# EAGLE design lattice-isp (EAGLE 6.3)
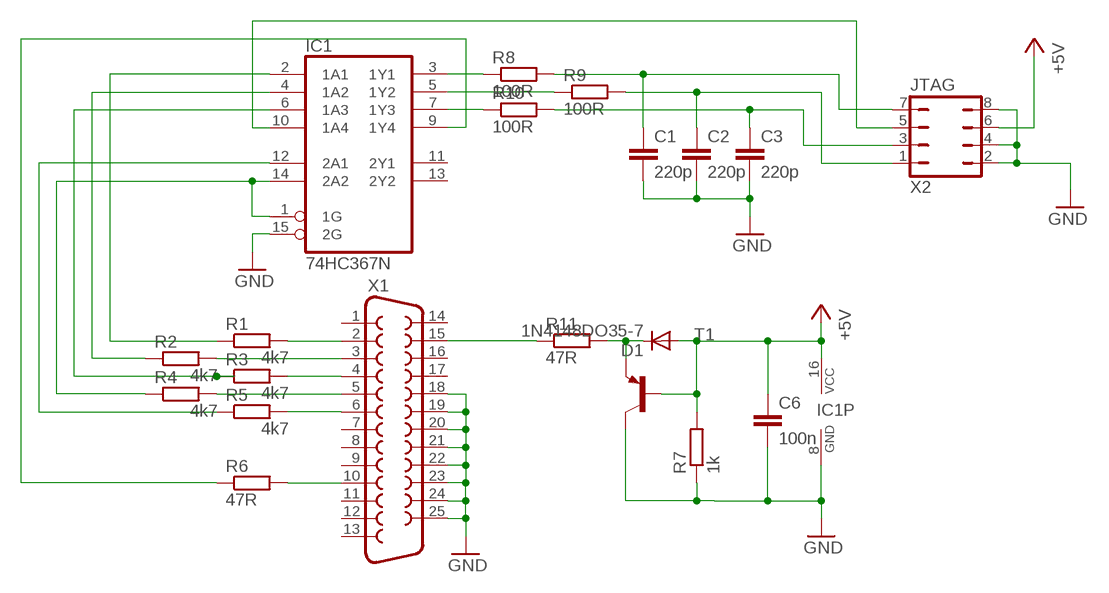
[diagram p0: schematic, sheet 1]

## Parts
C1  220p  C-EU025-024X044  [C025-024X044]
C2  220p  C-EU025-024X044  [C025-024X044]
C3  220p  C-EU025-024X044  [C025-024X044]
C6  100n  C-EU050-024X044  [C050-024X044]
D1  1N4148DO35-7  [DO35-7]
IC1  74HC367N  [DIL16]
R1  4k7  R-EU_0207/10  [0207/10]
R2  4k7  R-EU_0207/10  [0207/10]
R3  4k7  R-EU_0207/10  [0207/10]
R4  4k7  R-EU_0207/10  [0207/10]
R5  4k7  R-EU_0207/10  [0207/10]
R6  47R  R-EU_0207/10  [0207/10]
R7  1k  R-EU_0207/10  [0207/10]
R8  100R  R-EU_0207/10  [0207/10]
R9  100R  R-EU_0207/10  [0207/10]
R10  100R  R-EU_0207/10  [0207/10]
R11  47R  R-EU_0207/10  [0207/10]
T1  BC636-PNP-TO92-BCE  [TO92-BCE]
X1  F25HP  [F25HP]
X2  JTAG  JP4Q  [JP4Q]

## Nets
+5V: C6.1 D1.A IC1.16(VCC) R7.2 T1.B X2.6
GND: C1.2 C2.2 C3.2 C6.2 IC1.8(GND) IC1.15(2G) R7.1 T1.C X1.18 X1.19 X1.20 X1.21 X1.22 X1.23 X1.24 X1.25 X2.2 X2.4 X2.8
N$1: IC1.3(1Y1) R8.1
N$2: R1.2 X1.2
N$3: R2.2 X1.3
N$4: R3.2 X1.4
N$5: R4.2 X1.5
N$6: R5.2 X1.6
N$7: R6.2 X1.10
N$8: IC1.2(1A1) R1.1
N$9: IC1.4(1A2) R2.1
N$10: IC1.6(1A3) R3.1
N$11: IC1.1(1G) IC1.14(2A2) R4.1
N$13: IC1.12(2A1) R5.1
N$14: IC1.9(1Y4) R6.1
N$15: IC1.5(1Y2) R9.1
N$16: IC1.7(1Y3) R10.1
N$19: C3.1 R10.2 X2.3
N$21: D1.C R11.2 T1.E
N$22: R11.1 X1.15
TCK: C2.1 R9.2 X2.1
TDI: C1.1 R8.2 X2.7
TDO: IC1.10(1A4) X2.5
Unconnected: IC1.11(2Y1) IC1.13(2Y2) X1.1 X1.7 X1.8 X1.9 X1.11 X1.12 X1.13 X1.14 X1.16 X1.17

## Library data of the parts
C1-C3 C6 = rcl:C-EU: CAPACITOR, European symbol
D1 = diode:1N4148: DIODE high speed (Philips)
IC1 = 74xx-eu:74*367: Hex BUS DRIVER, 3-state
R1-R11 = rcl:R-EU_: RESISTOR, European symbol
T1 = transistor:*-PNP-: PNP Transistror
X1 = con-subd:F25: SUB-D; OC_FARNELL: unknown; OC_NEWARK: unknown
X2 = jumper:JP4Q: JUMPER

## Board
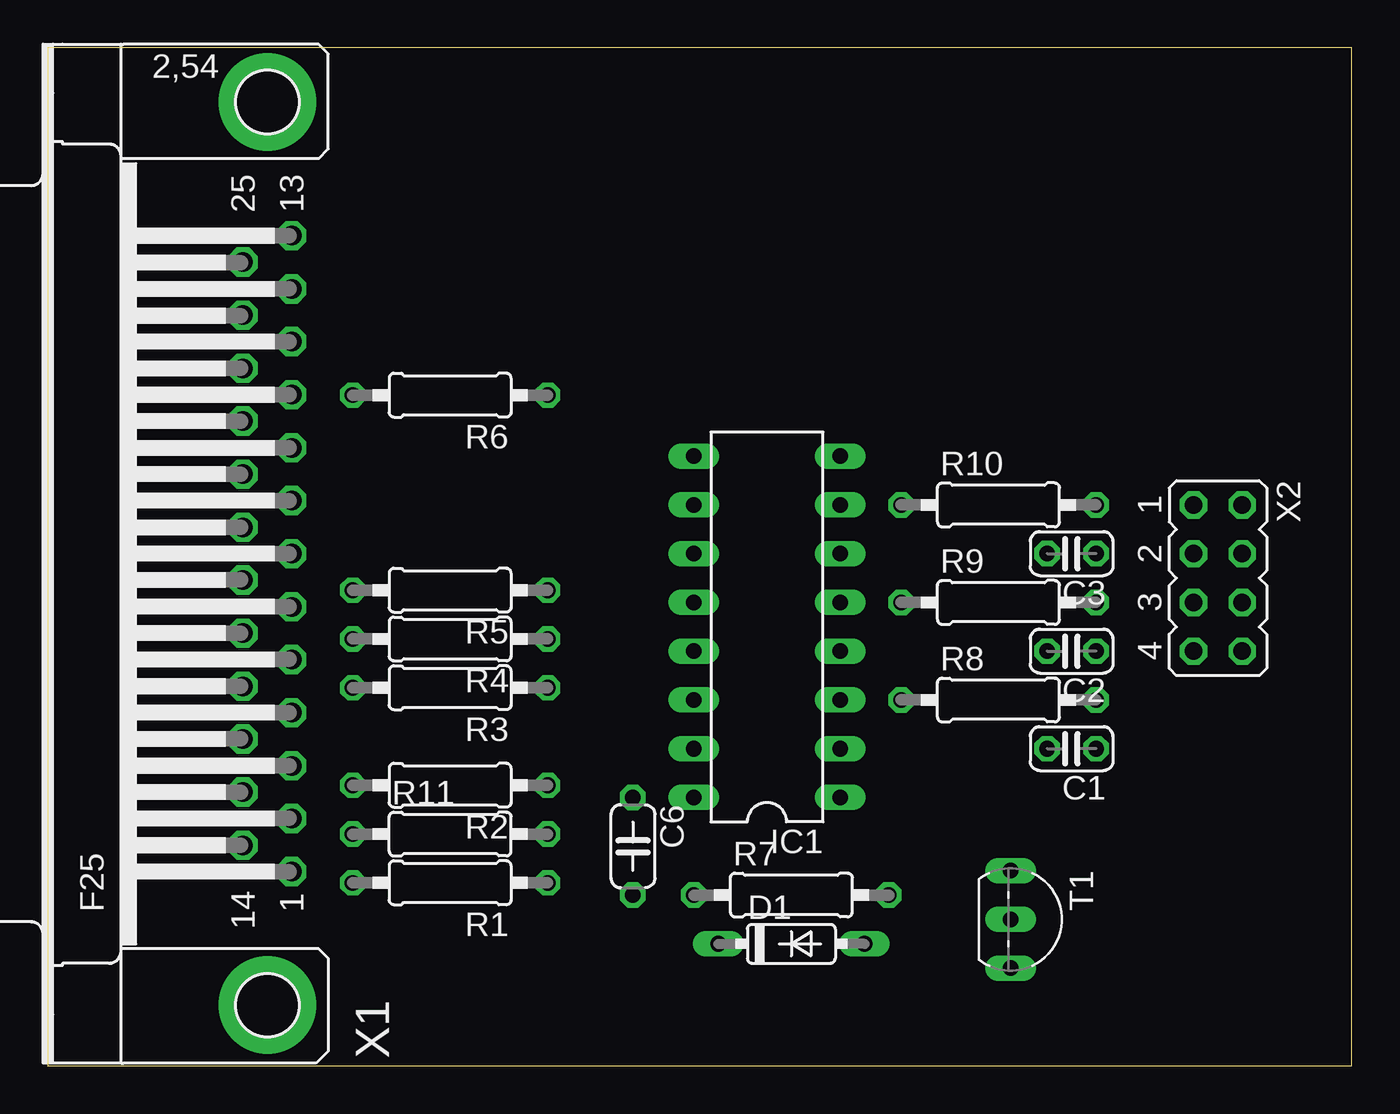
[diagram p1: board, top side]
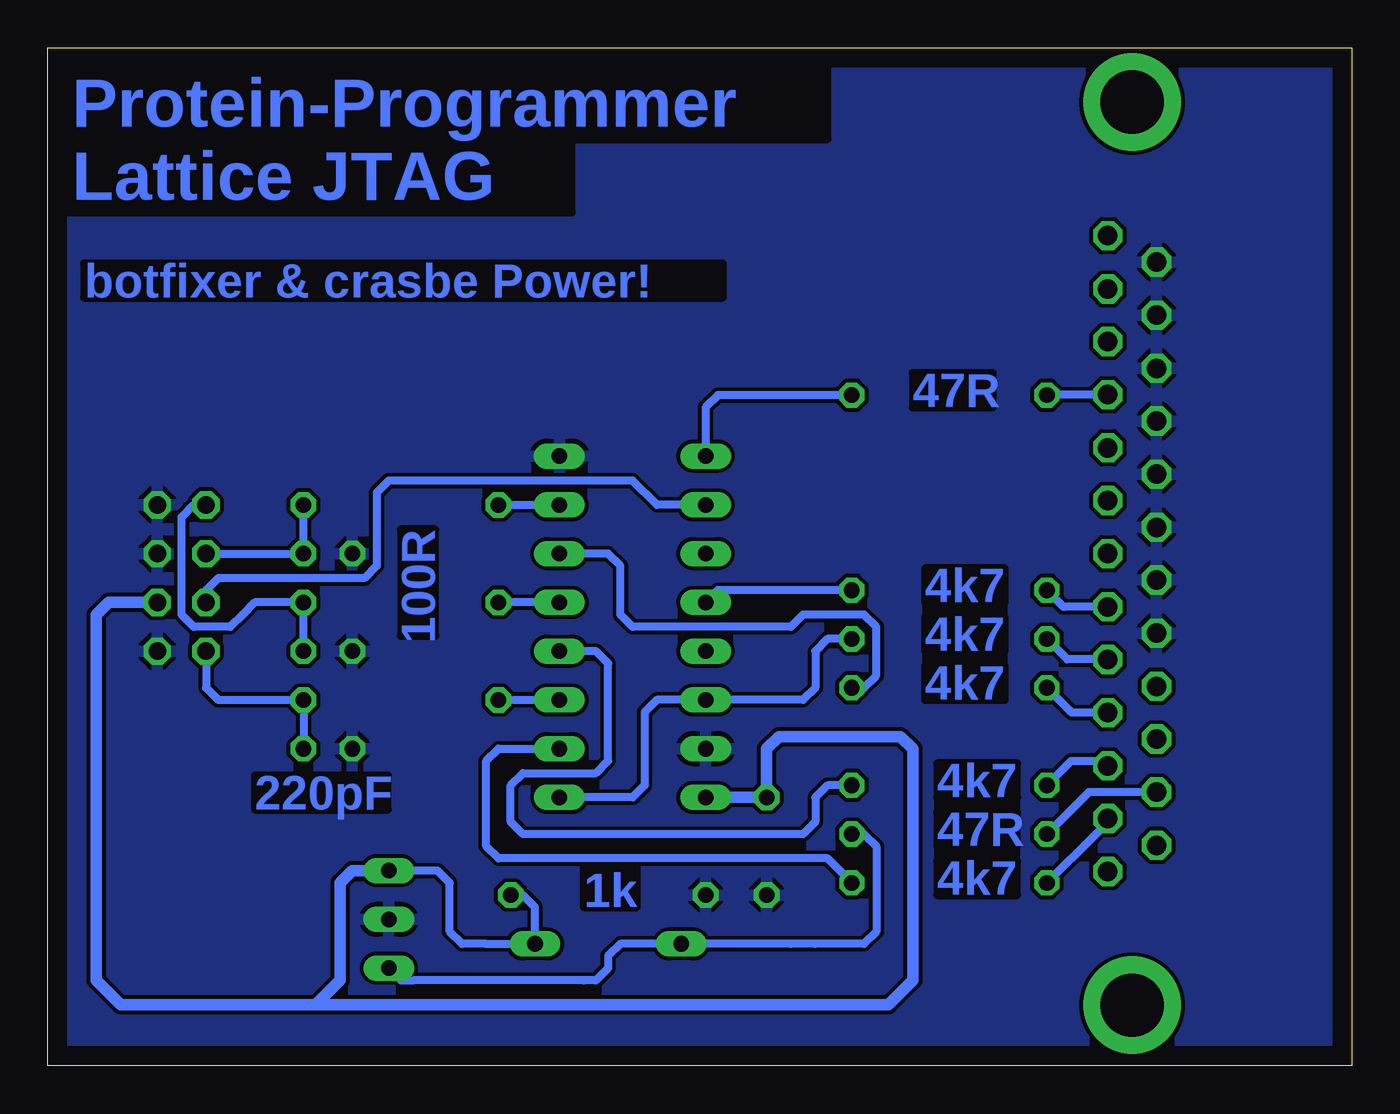
[diagram p2: board, bottom side, seen from below]

Size 67.92 x 53.01 mm. Coordinates in mm from the lower left corner, seen from the top.
Outline: 0,0 67.92,0 67.92,53.01 0,53.01 0,0
Copper layers (1*16): Top 0.035mm / dielectric 1.5mm / Bottom 0.035mm
Design rules "default": minimum track width 10mil, minimum drill 24mil, track to track 8mil, track to pad 8mil, pad to pad 8mil, via to via 8mil, smd to smd 8mil, copper to edge 40mil, drill to drill 8mil, minimum pad ring 10mil, minimum via ring 8mil, stop-mask expansion 4mil, vias tented up to drill 0mil, thermal gap 10mil

### Footprints (pad centres in the part's own frame; a part is rotated, then mirrored left to right if it is on the bottom)
C025-024X044 = drill 0.813 octagon: 1 -1.27,0; 2 1.27,0
C050-024X044 = drill 0.813 octagon: 1 -2.54,0; 2 2.54,0
DO35-7 = drill 0.813 long: A 3.81,0; C -3.81,0
DIL16 = drill 0.813 long: 1 -8.89,-3.81; 2 -6.35,-3.81; 3 -3.81,-3.81; 4 -1.27,-3.81; 5 1.27,-3.81; 6 3.81,-3.81; 7 6.35,-3.81; 8 8.89,-3.81; 9 8.89,3.81; 10 6.35,3.81; 11 3.81,3.81; 12 1.27,3.81; 13 -1.27,3.81; 14 -3.81,3.81; 15 -6.35,3.81; 16 -8.89,3.81
0207/10 = drill 0.813 octagon: 1 -5.08,0; 2 5.08,0
TO92-BCE = drill 0.813 long: B -2.54,0; C 0,0; E 2.54,0
F25HP = drill 1.016 octagon: 1 -16.561,-1.27; 2 -13.792,-1.27; 3 -11.049,-1.27; 4 -8.28,-1.27; 5 -5.512,-1.27; 6 -2.769,-1.27; 7 0,-1.27; 8 2.769,-1.27; 9 5.512,-1.27; 10 8.28,-1.27; 11 11.049,-1.27; 12 13.792,-1.27; 13 16.561,-1.27; 14 -15.189,1.27; 15 -12.421,1.27; 16 -9.652,1.27; 17 -6.909,1.27; 18 -4.14,1.27; 19 -1.372,1.27; 20 1.372,1.27; 21 4.14,1.27; 22 6.909,1.27; 23 9.652,1.27; 24 12.421,1.27; 25 15.189,1.27 | drill 3.302 pad 5.08: G1 -23.52,0; G2 23.52,0
JP4Q = drill 0.914 octagon: 1 -3.81,-1.27; 2 -3.81,1.27; 3 -1.27,-1.27; 4 -1.27,1.27; 5 1.27,-1.27; 6 1.27,1.27; 7 3.81,-1.27; 8 3.81,1.27

### Placement (x,y rotation side)
C1  53.34,16.51 180 top
C2  53.34,21.59 180 top
C3  53.34,26.67 180 top
C6  30.48,11.43 270 top
D1  38.73,6.35 0 top
IC1  37.47,22.86 90 top
R1  20.95,9.53 180 top
R2  20.95,14.61 180 top
R3  20.95,19.68 180 top
R4  20.95,22.23 180 top
R5  20.95,24.77 180 top
R6  20.95,34.92 180 top
R7  38.73,8.89 0 top
R8  49.53,19.05 0 top
R9  49.53,24.13 0 top
R10  49.53,29.21 0 top
R11  20.95,12.06 0 top
T1  50.16,7.62 270 top
X1  11.43,26.67 90 top
X2  60.96,25.4 270 top

### Tracks (layer width: path | path; a pad name or v marks a point on that pad's centre or on a via)
+5V
  Bottom 0.406: R7.2 43.18,8.89 42.55,8.26 D1.A 45.09,6.35 46.35,6.35 46.99,6.99 46.99,9.53 47.62,10.16 T1.B
  Bottom 0.61: IC1.16 C6.1 30.48,16.51 29.84,17.14 23.5,17.14 22.86,16.51 22.86,4.45 24.13,3.17 54.61,3.17 | 54.61,3.17 64.14,3.17 65.41,4.45 65.41,23.5 64.77,24.13 X2.6 | 54.61,3.17 53.98,3.17 52.7,4.45 52.7,9.53 52.07,10.16 T1.B
GND
  pour Bottom: 0,52.7 0,0 67.94,0 67.94,52.7
N$1
  Bottom 0.406: R8.1 IC1.3
N$2
  Bottom 0.406: R1.2 13.34,12.06 12.7,12.7 12.88,12.7 X1.2
N$3
  Bottom 0.406: R2.2 14.61,15.88 12.95,15.88 X1.3
N$4
  Bottom 0.406: X1.4 14.58,18.39 R3.2
N$5
  Bottom 0.406: X1.5 14.81,21.16 R4.2
N$6
  Bottom 0.406: X1.6 15.01,23.9 R5.2
N$7
  Bottom 0.406: X1.10 15.85,34.95 R6.2
N$8
  Bottom 0.406: R1.1 27.3,10.79 44.45,10.79 45.09,11.43 45.09,15.88 44.45,16.51 IC1.2
N$9
  Bottom 0.406: R2.1 27.3,14.61 27.94,13.97 27.94,12.7 28.57,12.06 43.18,12.06 43.81,12.7 43.81,14.61 43.18,15.24 39.37,15.24 38.73,15.88 38.73,20.95 39.37,21.59 IC1.4
N$10
  Bottom 0.406: R3.1 25.4,19.68 24.77,20.32 24.77,22.86 25.4,23.5 28.57,23.5 29.21,22.86 37.47,22.86 38.1,23.5 38.1,26.04 38.73,26.67 IC1.6
N$11
  Bottom 0.406: R4.1 27.3,22.23 27.94,21.59 27.94,19.68 28.57,19.05 IC1.14 36.2,19.05 36.83,18.41 36.83,14.61 37.47,13.97 IC1.1
N$12
  cutout Bottom: 67.94,44.45 40.64,44.45 40.64,48.26 27.94,48.26 27.3,48.26 27.3,52.7 67.94,52.7
N$13
  Bottom 0.406: R5.1 33.02,24.77 IC1.12
N$14
  Bottom 0.406: R6.1 33.02,34.92 33.66,34.29 IC1.9
N$15
  Bottom 0.406: IC1.5 R9.1
N$16
  Bottom 0.406: R10.1 IC1.7
N$19
  Bottom 0.406: R10.2 C3.1 X2.3
N$21
  Bottom 0.406: R11.2 25.4,12.06 24.77,11.43 24.77,6.99 25.4,6.35 27.94,6.35 29.21,6.35 D1.C 38.1,6.35 38.73,5.71 38.73,5.08 39.37,4.45 40.01,4.45 48.9,4.45 49.53,4.45 T1.E
N$22
  Bottom 0.406: X1.15 13.69,14.25 R11.1
TCK
  Bottom 0.406: C2.1 R9.2 57.15,24.13 57.78,23.5 58.42,22.86 60.33,22.86 60.96,23.5 60.96,28.57 60.33,29.21 X2.1
TDI
  Bottom 0.406: C1.1 R8.2 59.05,19.05 59.69,19.68 59.69,20.95 X2.7
TDO
  Bottom 0.406: IC1.10 36.2,29.21 37.47,30.48 50.16,30.48 50.8,29.84 50.8,26.04 51.44,25.4 59.05,25.4 59.69,24.77 X2.5

### Text on the board
Bottom: Protein-Programmer | Lattice JTAG | botfixer & crasbe Power! | 47R | 100R | 4k7 | 4k7 | 4k7 | 4k7 | 220pF | 47R | 4k7 | 1k